# Altium schematic sheet mcu_headers.SchDoc
size A4; SheetNumber: 4; SheetTotal: 6
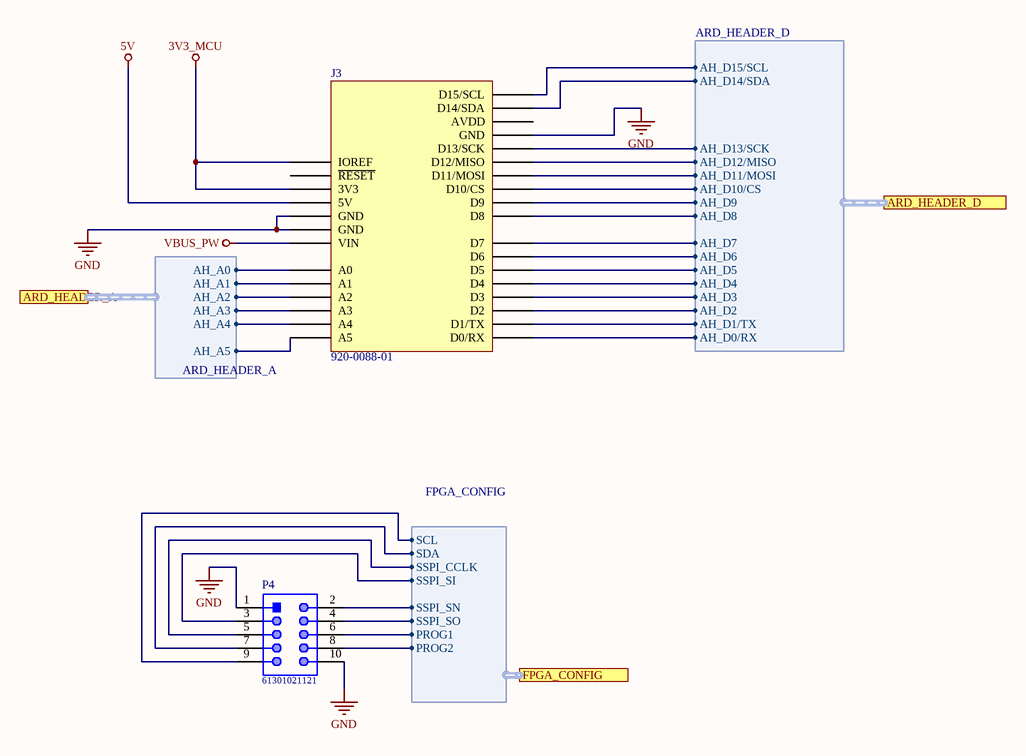
[diagram p0: mcu_headers.SchDoc]

## Parts
J3  920-0088-01  [SCHMARTBOARD - 920-0088-01]
P4  61301021121  [61301021121]

## Ports
ARD_HEADER_A (harness ARD_HEADER_A), ARD_HEADER_D (harness ARD_HEADER_D), FPGA_CONFIG (harness FPGA_CONFIG)

## Harnesses
ARD_HEADER_D: AH_D15/SCL, AH_D14/SDA, AH_D13/SCK, AH_D12/MISO, AH_D11/MOSI, AH_D10/CS, AH_D9, AH_D8, AH_D7, AH_D5, AH_D4, AH_D3, AH_D2, AH_D1/TX, AH_D0/RX, AH_D6
FPGA_CONFIG: SSPI_SN, SSPI_SO, PROG1, PROG2, SSPI_SI, SSPI_CCLK, SDA, SCL
ARD_HEADER_A: AH_A0, AH_A1, AH_A2, AH_A3, AH_A4, AH_A5

## Nets
3V3_MCU: J3.2(IOREF) J3.4(3V3)
5V: J3.5(5V)
GND: J3.6(GND) J3.7(GND) J3.29(GND) P4.1 P4.10
VBUS_PW: J3.8(VIN)
NetJ3_9: J3.9(A0) ; port ARD_HEADER_A.AH_A0
NetJ3_10: J3.10(A1) ; port ARD_HEADER_A.AH_A1
NetJ3_11: J3.11(A2) ; port ARD_HEADER_A.AH_A2
NetJ3_12: J3.12(A3) ; port ARD_HEADER_A.AH_A3
NetJ3_13: J3.13(A4) ; port ARD_HEADER_A.AH_A4
NetJ3_14: J3.14(A5) ; port ARD_HEADER_A.AH_A5
NetJ3_15: J3.15(D0/RX) ; port ARD_HEADER_D.AH_D0/RX
NetJ3_16: J3.16(D1/TX) ; port ARD_HEADER_D.AH_D1/TX
NetJ3_17: J3.17(D2) ; port ARD_HEADER_D.AH_D2
NetJ3_18: J3.18(D3) ; port ARD_HEADER_D.AH_D3
NetJ3_19: J3.19(D4) ; port ARD_HEADER_D.AH_D4
NetJ3_20: J3.20(D5) ; port ARD_HEADER_D.AH_D5
NetJ3_21: J3.21(D6) ; port ARD_HEADER_D.AH_D6
NetJ3_22: J3.22(D7) ; port ARD_HEADER_D.AH_D7
NetJ3_23: J3.23(D8) ; port ARD_HEADER_D.AH_D8
NetJ3_24: J3.24(D9) ; port ARD_HEADER_D.AH_D9
NetJ3_25: J3.25(D10/CS) ; port ARD_HEADER_D.AH_D10/CS
NetJ3_26: J3.26(D11/MOSI) ; port ARD_HEADER_D.AH_D11/MOSI
NetJ3_27: J3.27(D12/MISO) ; port ARD_HEADER_D.AH_D12/MISO
NetJ3_28: J3.28(D13/SCK) ; port ARD_HEADER_D.AH_D13/SCK
NetJ3_31: J3.31(D14/SDA) ; port ARD_HEADER_D.AH_D14/SDA
NetJ3_32: J3.32(D15/SCL) ; port ARD_HEADER_D.AH_D15/SCL
NetP4_2: P4.2 ; port FPGA_CONFIG.SSPI_SN
NetP4_3: P4.3 ; port FPGA_CONFIG.SSPI_SI
NetP4_4: P4.4 ; port FPGA_CONFIG.SSPI_SO
NetP4_5: P4.5 ; port FPGA_CONFIG.SSPI_CCLK
NetP4_6: P4.6 ; port FPGA_CONFIG.PROG1
NetP4_7: P4.7 ; port FPGA_CONFIG.SDA
NetP4_8: P4.8 ; port FPGA_CONFIG.PROG2
NetP4_9: P4.9 ; port FPGA_CONFIG.SCL

Not connected (* = marked no-connect by the designer): J3 3(~{RESET}) 30(AVDD)

## Library data of the parts
J3 = 920-0088-01: CONN HDR 8/10P 0.1 GOLD PCB 6PC; Manufacturer: Schmartboard, Inc.; Connector Type: Header; Contact Length - Post: 0.413" (10.50mm); Number of Positions: 6, 8, 10; Number of Positions Loaded: All; Pitch - Mating: 0.100" (2.54mm); Style: Board to Board; Part Number: 920-0088-01; ComponentLink1Description: Datasheet; ComponentLink1URL: http://schmartboard.com/content/Brochures/920-0088-01.pdf; ComponentLink2Description: DigiKey Link; ComponentLink2URL: http://digikey.com/product-detail/en/schmartboard-inc/920-0088-01/1988-1036-ND/9559319; Contact Finish - Mating: Gold; Contact Finish - Post: Gold; Contact Type: Female Socket; Fastening Type: Push-Pull; Insulation Color: Black; Insulation Height: 0.335" (8.51mm); LastUpdated: 31.01.2020 20:49:58; Lifecycle Status: Active; Minimum Order: 1; Mounting Type: Through Hole; Number of Rows: 1; Packaging: Bulk; Part Status: Active; Price: 5.00; Series: -; Supplier 1: DigiKey; Supplier Part Number 1: 1988-1036-ND; Termination: Solder
P4 = CMP-1502-01084-1: THT Vertical Pin Header WR-PHD, Pitch 2.54 mm, Dual Row, 10 pins; Manufacturer: Wurth Elektronik; Working Voltage: 250VAC; Pitch: 2.54mm; Contact Resistance: 20mOhm; Gender: Male; Rated Current: 3A; Withstanding Voltage: 500VAC; Pin Number: 10; Operating Temperature: -40to105degC; Mounting Technology: THT; Publisher: WurthElektronik; Manufacturer URL: http://www.we-online.de; Part Number: 61301021121; Row Number: Dual; Packaging: Bag; Orientation: Vertical; Package Reference: 61301021121; Datasheet URL: https://katalog.we-online.de/em/datasheet/6130xx21121.pdf